# EAGLE schematic sensore_temp (EAGLE 9.6.2)
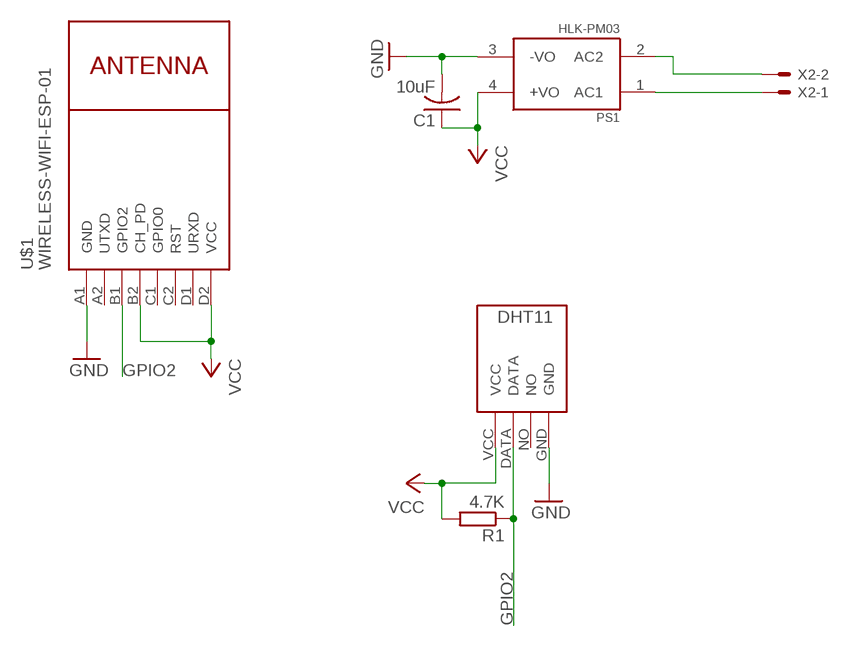
[diagram p0: schematic, sheet 1]

## Parts
C1  10uF  C-US025-025X050  [C025-025X050]
PS1  HLK-PM03  [CONV_HLK-PM03]
R1  4.7K  R-EU_0204/7  [0204/7]
U$1  WIRELESS-WIFI-ESP-01  [WIRELESS-WIFI-ESP-01]
U$2  DHT11  [DHT11]
X2  JST-XH-02-PIN-LONG-PAD  [JST-XH-02-PACKAGE-LONG-PAD]

## Nets
GND: C1.2 PS1.3(-VO) U$1.A1(GND) U$2.GND
GPIO2: R1.1 U$1.B1(GPIO2) U$2.DATA
N$1: PS1.1(AC1) X2.1
N$2: PS1.2(AC2) X2.2
VCC: C1.1 PS1.4(+VO) R1.2 U$1.B2(CH_PD) U$1.D2(VCC) U$2.VCC
Unconnected: U$1.A2(UTXD) U$1.C1(GPIO0) U$1.C2(RST) U$1.D1(URXD) U$2.NO

## Library data of the parts
C1 = adafruit:C-US: CAPACITOR, American symbol
PS1 = HLK-PM03:HLK-PM03: AC DC 3W power module Check availability <https://pricing.snapeda.com/parts/HLK-PM03/Hi-link/view-part?ref=eda>; AVAILABILITY: Not in stock; MF: Hi-link; MP: HLK-PM03; PACKAGE: Package; PRICE: None
R1 = rcl:R-EU_: RESISTOR, European symbol; SPICEPREFIX: R
U$1 = diy-modules:WIRELESS-WIFI-ESP-01: Wireless Wi-Fi ESP-01 Module based on ESP8266 chip Click here to find device on ebay.com <http://www.ebay.com/sch/esp8266+esp+01+transceiver>
U$2 = DHT11:DHT11: DHT11 Czujnik temperatury i wilgotności
X2 = jstConnector-2.5:JST-XH-02-PIN: JST XH Connector 2 Pin Wire to board connector. Pitch: 2,54 mm, (0.100") Number of pins: 2 Created by Rembrandt Electronics www.rembrandtelectronics.com